# Altium schematic sheet INT_REG.SchDoc
size A; SheetNumber: 4; SheetTotal: 9
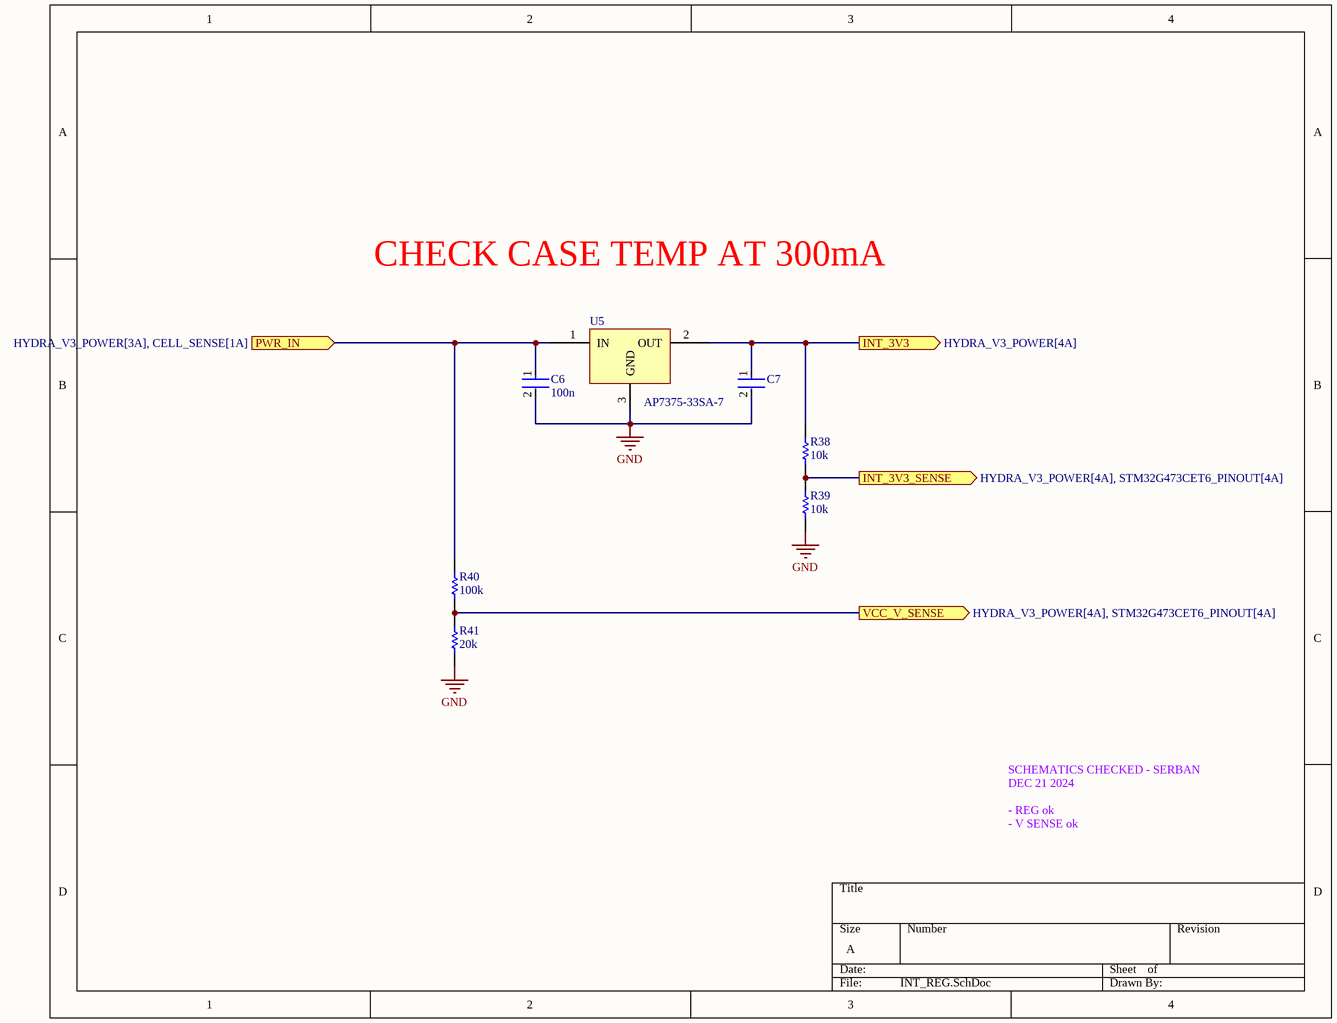
[diagram p0: INT_REG.SchDoc]

## Parts
C6  100n  [FP-0402-L_1_0_0_05-W_0_5-IPC_A]
C7  GRM188R61E106KA73D  [FP-GRM188-0_2-IPC_A]  (value not drawn)
R38  10k  [R0603B]
R39  10k  [R0603B]
R40  100k  [R0603B]
R41  20k  [R0603B]
U5  AP7375-33SA-7  [SOT90P285X110-3N]

## Ports
INT_3V3 (out, see HYDRA_V3_POWER[4A]), INT_3V3_SENSE (out, see HYDRA_V3_POWER[4A], STM32G473CET6_PINOUT[4A]), PWR_IN (in, see HYDRA_V3_POWER[3A], CELL_SENSE[1A]), VCC_V_SENSE (out, see HYDRA_V3_POWER[4A], STM32G473CET6_PINOUT[4A])

## Nets
GND: C6.2 C7.2 R39.1 R41.1 U5.3(GND)
INT_3V3: C7.1 R38.2 U5.2(OUT) ; port INT_3V3
INT_3V3_SENSE: R38.1 R39.2 ; port INT_3V3_SENSE
PWR_IN: C6.1 R40.2 U5.1(IN) ; port PWR_IN
VCC_V_SENSE: R40.1 R41.2 ; port VCC_V_SENSE

## Notes on the sheet
- CHECK CASE TEMP AT 300mA
- SCHEMATICS CHECKED - SERBAN
  DEC 21 2024
  - REG ok
  - V SENSE ok

## Library data of the parts
C6 = CMP-001-00058-1: LARGE PADS, 0402 CAP, CHANGE COMMENT TO MATCH REAL P/N; Capacitor Type: Ceramic; Min Operating Temperature: -55°C; Mounting Technology: Surface Mount; Pins: 2; Case/Package: 0402; RoHS Compliant: Yes; Max Operating Temperature: 85°C
C7 = CMP-06035-045268-1: Chip Multilayer Ceramic Capacitors for General Purpose, 0603, 10uF, X5R, 15%, 10%, 25V; Case/Package: 0603
R38-R41 = CMP-009-00002-14: Resistor
U5 = CMP-019-00039-1: LDO Regulator Pos 3.3V 0.3A 3-Pin SOT-23 T/R